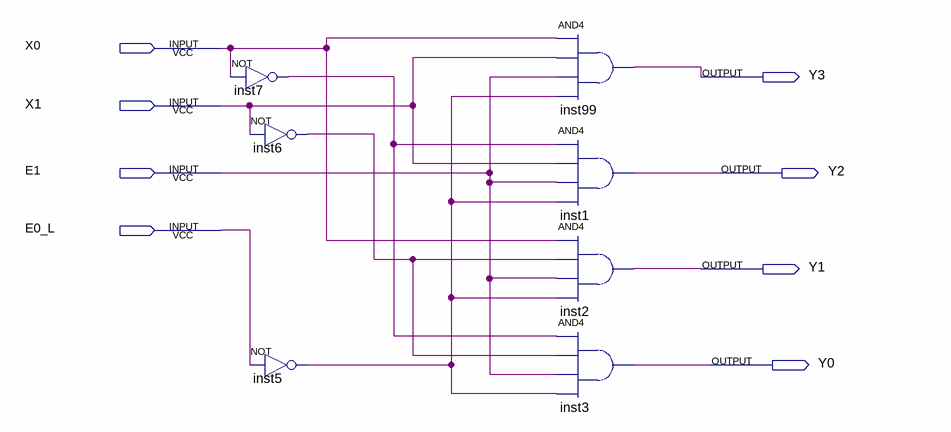
[diagram p0: schematic sheet]
// Quartus schematic dec2_4.bdf as structural Verilog: 7 symbols, 8 pins
module dec2_4 (
  input  X0,
  input  X1,
  input  E1,
  input  E0_L,
  output Y3,
  output Y2,
  output Y1,
  output Y0
);

  wire inst5_out, inst6_out, inst7_out;

  not inst7 (inst7_out, X0);
  not inst6 (inst6_out, X1);
  not inst5 (inst5_out, E0_L);
  and inst99 (Y3, X0, X1, E1, inst5_out);
  and inst1 (Y2, inst7_out, X1, E1, inst5_out);
  and inst2 (Y1, X0, inst6_out, E1, inst5_out);
  and inst3 (Y0, inst7_out, inst6_out, E1, inst5_out);
endmodule
